# EasyEDA Pro project PCB_ESP32 Marauder 6.eprj

# Board PCB_ESP32 Marauder 6 PCB_2022-04-29
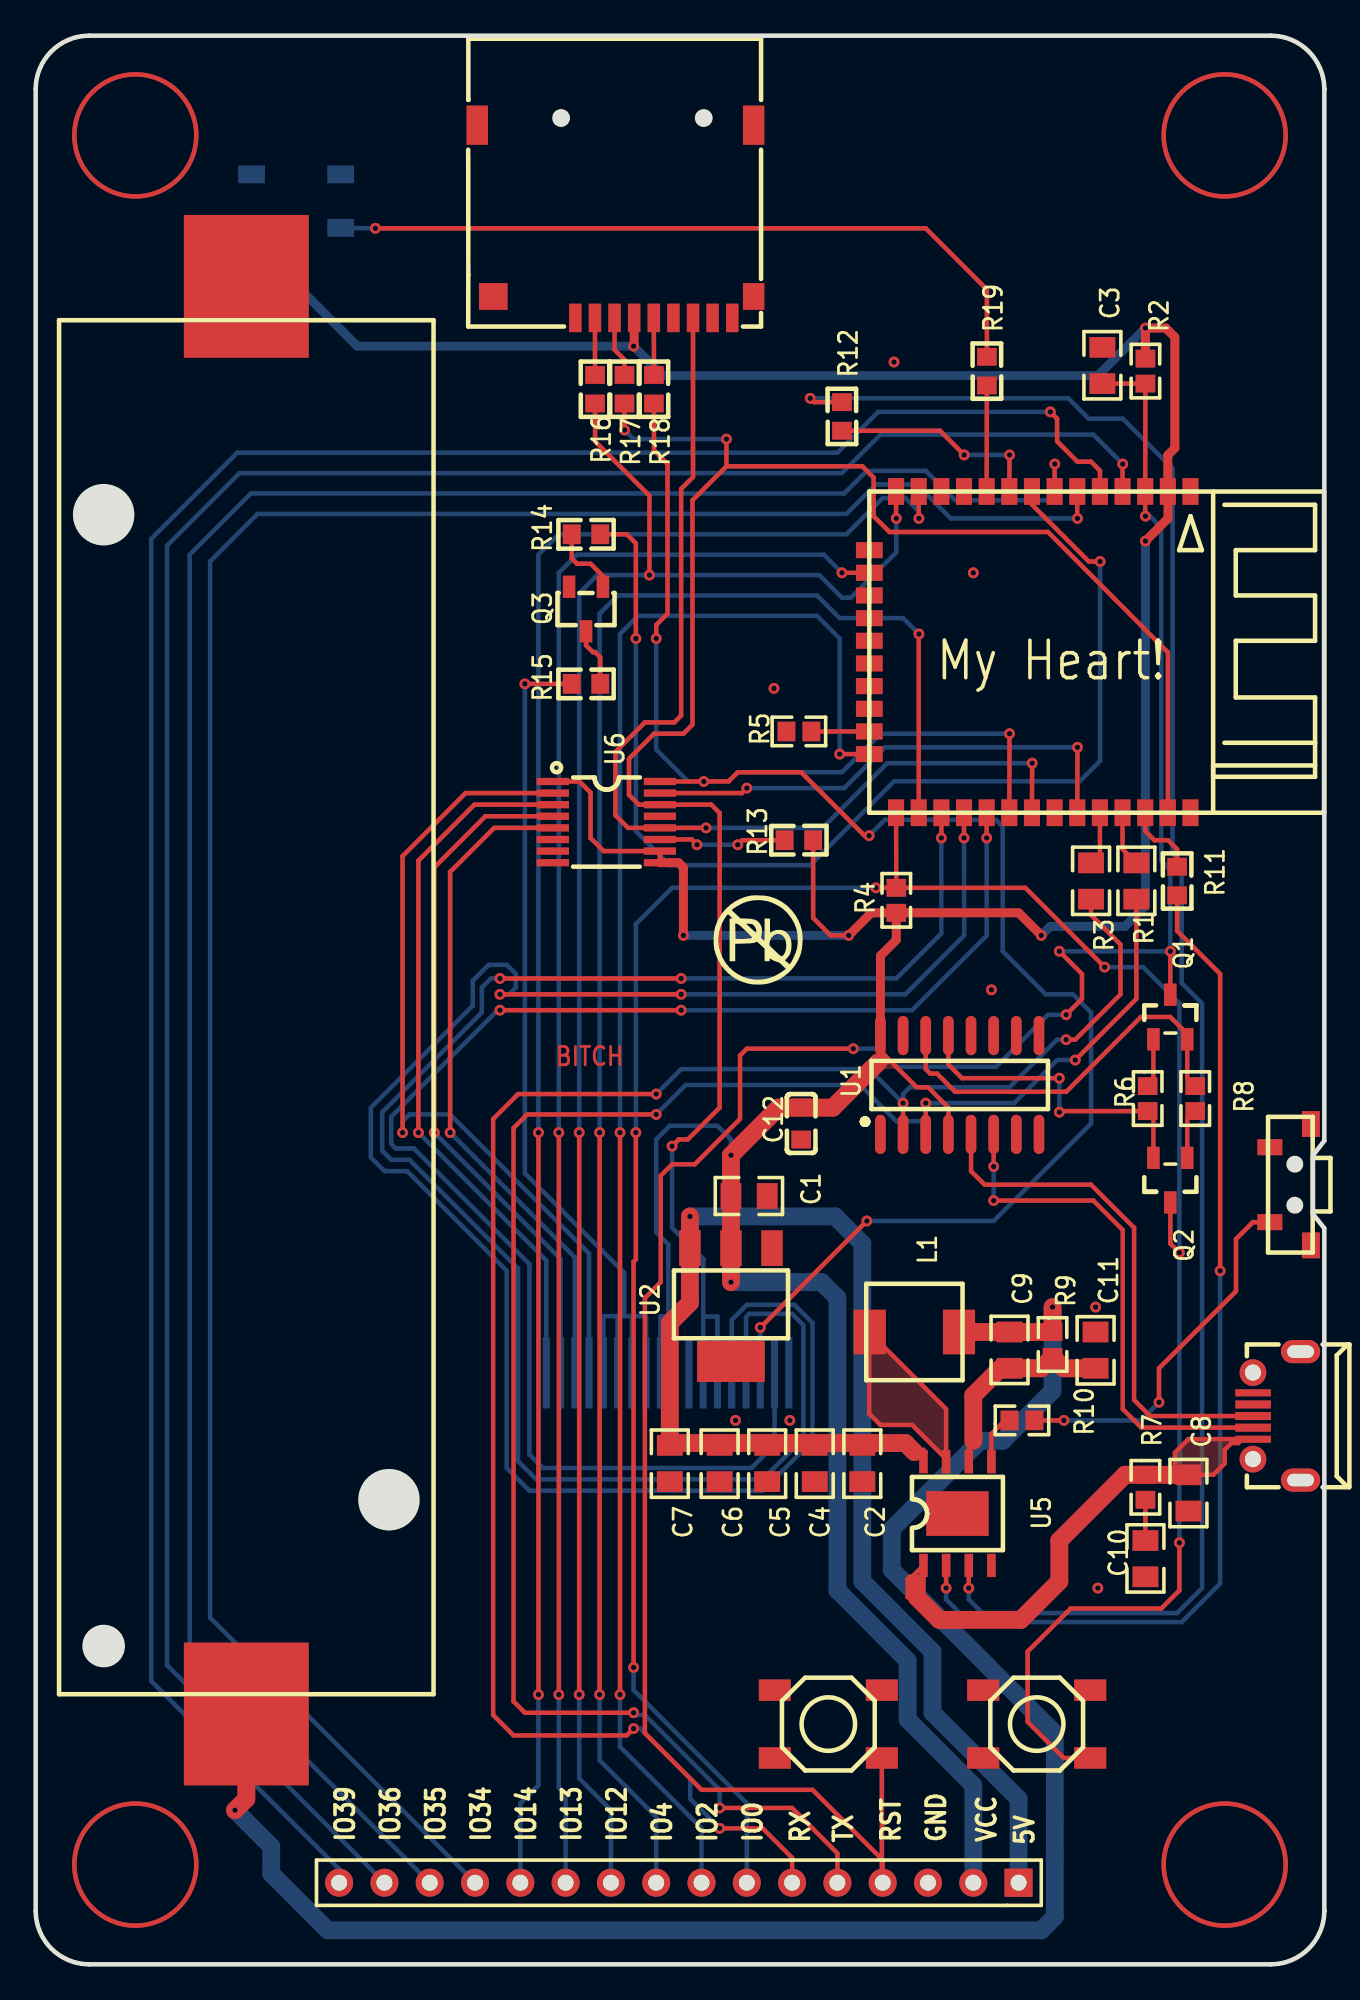
[diagram p0: board, top side]
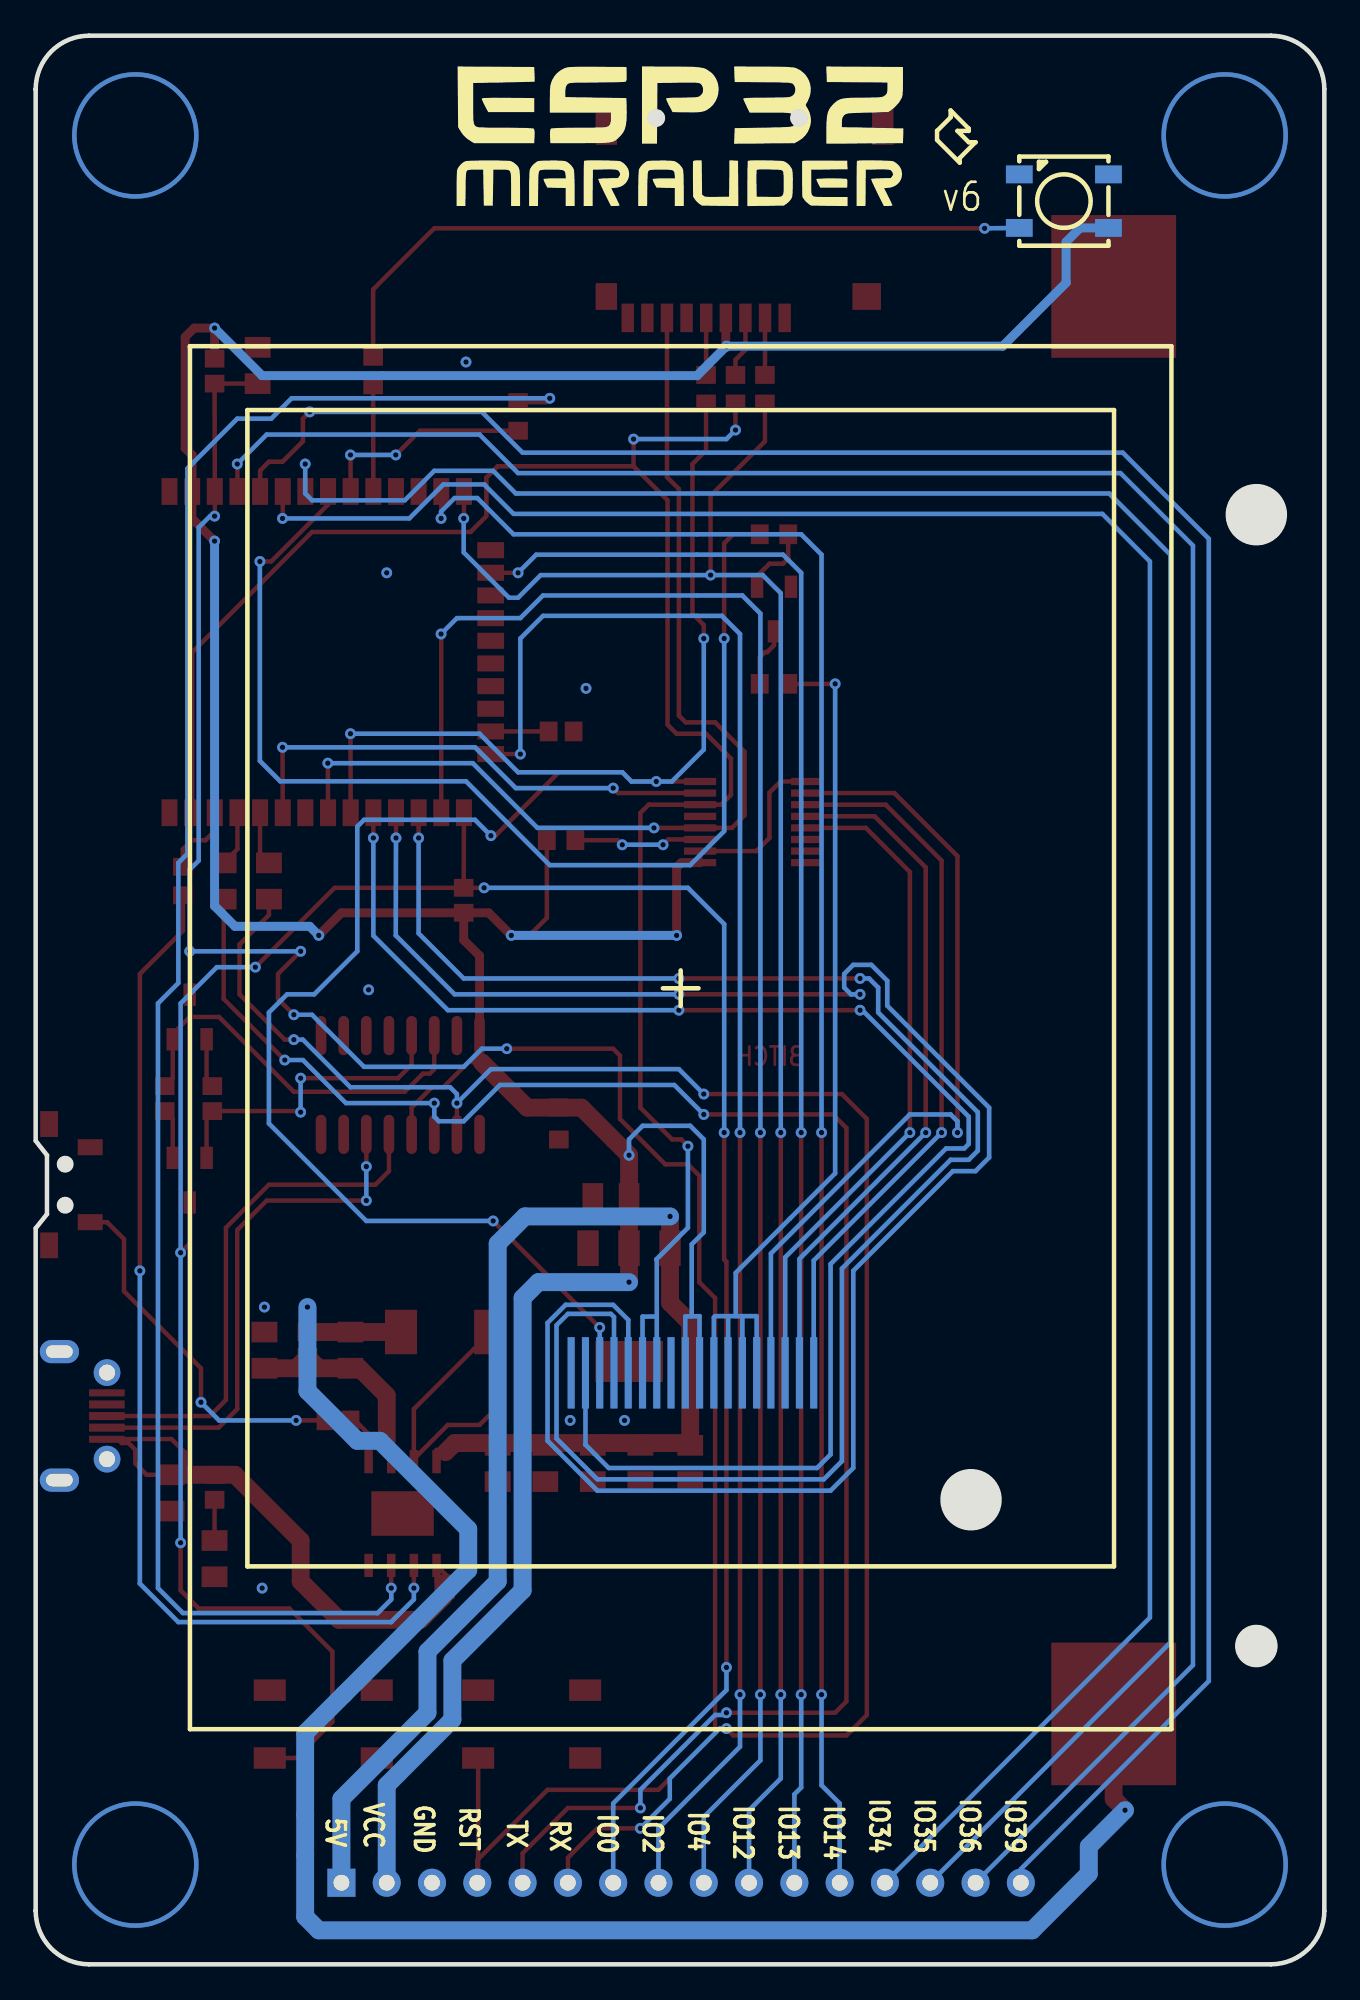
[diagram p1: board, bottom side, seen from below]

Outline 72.26 x 108.08 mm; copper layers: Top Layer, Bottom Layer. Coordinates in mm from the lower left corner of the outline.
Outline path: 0,105.08 arc(0.88,107.2) 3,108.08 69.26,108.08 arc(71.38,107.2) 72.26,105.08 72.26,46.15 71.63,45.34 71.63,42.04 72.26,41.25 72.26,3 arc(71.38,0.88) 69.26,0 3,0 arc(0.88,0.88) 0,3 0,105.08
Stack: Top Layer 0.035mm / Dielectric1 1.51mm FR4 er 4.5 / Bottom Layer 0.035mm

## Design rules (mm)
spacing Default (default): track to track 0.152, other pairs 0 to 0.152
track width Default (default): min 0.152, default 0.152, max 25.4
differential pair differentialPair (default): width min 0.127, default 0.254, max 2.54; gap min 0.152, default 0.152
via Default (default): diameter min 0.6, default 0.6, max 100.025; hole min 0.305, default 0.305, max 59.995
net GND uses (1)
pour e771 uses (1)

## Placement (name value [footprint] x y rotation side)
C1  10uF  [0805]  40.01 43.05 0 top
C2  100nF  [0805]  46.36 28.07 90 top
C3  100nF  [0805]  59.82 89.6 270 top
C4  22uF  [0805]  43.69 28.07 90 top
C5  22uF  [0805]  41.02 28.07 90 top
C6  22uF  [0805]  38.35 28.07 90 top
C7  22uF  [0805]  35.56 28.07 90 top
C8  10uF  [0805]  64.64 26.42 90 top
C9  22uF  [0805]  54.61 34.42 270 top
C10  10uF  [0805]  62.23 22.73 270 top
C11  22uF  [0805]  59.44 34.42 90 top
C12  100nF  [C0603]  42.93 47.12 90 top
CARD1  TF-115  [TF-SMD_TF-115]  32.51 97.66 180 top
FLASH1  FLASH  [KEY-5.2X5.2X1.5]  56.13 13.46 0 top
L1  1uH  [L-SMD-5.4X5.1]  49.28 35.43 0 top
LED1  WS2812B-B  [LED-SMD_4P-L5.0-W5.0-BL]  14.61 98.81 90 bottom
P1  Header-Female-2.54_1x16  [HDR-16X1/2.54]  36.07 4.57 270 top
Q1  S8050  [SOT-23(SOT-23-3)]  63.63 53.09 0 top
Q2  S8050  [SOT-23(SOT-23-3)]  63.63 43.94 180 top
Q3  S8050_C402279  [SOT-23-3_L3.0-W1.7-P0.95-LS2.9-BR]  30.86 75.95 90 top
R1  470Ω  [0805]  61.72 60.71 270 top
R2  10KΩ  [0603]  62.23 89.28 270 top
R3  470Ω  [0805]  59.18 60.71 270 top
R4  10KΩ  [0603]  48.26 59.62 90 top
R5  10KΩ  [0603]  42.8 69.09 0 top
R6  10KΩ  [0603]  62.36 48.51 270 top
R7  2  [0603]  62.23 26.73 270 top
R8  10KΩ  [0603]  65.02 48.51 90 top
R9  0.5  [0603]  57.02 34.73 270 top
R10  10KΩ  [0603]  55.31 30.48 0 top
R11  2.2K  [R0603]  64.01 60.71 270 top
R12  2.2K  [R0603]  45.21 86.74 90 top
R13  10K  [R0603]  42.8 62.99 0 top
R14  1K  [R0603]  30.86 80.14 180 top
R15  10  [R0603]  30.86 71.75 180 top
R16  1K  [R0603]  31.37 88.27 90 top
R17  1K  [R0603]  33.02 88.27 90 top
R18  1K  [R0603]  34.67 88.27 90 top
R19  330  [R0603]  53.34 89.28 270 top
RESET1  RESET  [KEY-5.2X5.2X1.5]  44.45 13.46 0 top
SW1  POWER  [KEY-TACT-SMD-7.6*3.5*3.5]  70.36 43.69 180 top
U1  CH340C  [SOP-16_150MIL]  51.82 49.28 90 top
U2  AMS1117-3.3  [SOT-223]  38.99 36.96 270 top
U3  -  [ESP-32S]  55.75 73.53 270 top
U5  IP5306  [ESOP-8-EP]  51.69 25.26 0 top
U6  XPT2046  [TSSOP-16_L5.0-W4.4-P0.65-LS6.4-BL]  32 64.01 270 top
U7  ILI9341_18_PIN  [ILI9341 18 PIN]  35.43 33.15 90 bottom
U8  1042P  [KEYSTONE 18650 BATTERY SLED]  19.81 26.03 270 top
USB1  MICROXNJ  [MICRO-USB-SMD_MICROXNJ]  69.6 30.73 0 top

## Footprints (pads in the part's own frame, mm; a bottom-side part is the same pattern mirrored in y, then rotated)
0603
  rect 1x1.1 smd: 1(-0.7,0) 2(0.7,0)
0805
  rect 1.16x1.45 smd: 1(-1.016,0) 2(1.016,0)
C0603
  rect 1x1.1 smd: 1(-0.9,0) 2(0.9,0)
ESOP-8-EP
  rect 0.48x1.3 smd: 1(-1.905,-2.909) 2(-0.635,-2.909) 3(0.635,-2.909) 4(1.905,-2.909) 5(1.905,2.909) 6(0.635,2.909) 7(-0.635,2.909) 8(-1.905,2.909)
  rect 3.5x2.5 smd: 9(0,0)
ESP-32S
  rect 1.5x0.9 smd: 1(-9,9.005) 2(-9,7.735) 3(-9,6.465) 4(-9,5.195) 5(-9,3.925) 6(-9,2.655) 7(-9,1.385) 8(-9,0.115) 9(-9,-1.155) 10(-9,-2.425) 11(-9,-3.695) 12(-9,-4.965) 13(-9,-6.235) 14(-9,-7.505) 25(9,-7.505) 26(9,-6.235) 27(9,-4.965) 28(9,-3.695) 29(9,-2.425) 30(9,-1.155) 31(9,0.115) 32(9,1.385) 33(9,2.655) 34(9,3.925) 35(9,5.195) 36(9,6.465) 37(9,7.735) 38(9,9.005)
  rect 0.9x1.5 smd: 15(-5.715,-9.005) 16(-4.445,-9.005) 17(-3.175,-9.005) 18(-1.905,-9.005) 19(-0.635,-9.005) 20(0.635,-9.005) 21(1.905,-9.005) 22(3.175,-9.005) 23(4.445,-9.005) 24(5.715,-9.005)
HDR-16X1/2.54
  rect 1.575x1.575 hole 0.889: 1(0,19.05)
  round 1.575 hole 0.889: 2(0,16.51) 3(0,13.97) 4(0,11.43) 5(0,8.89) 6(0,6.35) 7(0,3.81) 8(0,1.27) 9(0,-1.27) 10(0,-3.81) 11(0,-6.35) 12(0,-8.89) 13(0,-11.43) 14(0,-13.97) 15(0,-16.51) 16(0,-19.05)
ILI9341 18 PIN
  rect 4x0.4 smd: 1(0,6.8) 2(0,6) 3(0,5.2) 4(0,4.4) 5(0,3.6) 6(0,2.8) 7(0,2) 8(0,1.2) 9(0,0.4) 10(0,-0.4) 11(0,-1.2) 12(0,-2) 13(0,-2.8) 14(0,-3.6) 15(0,-4.4) 16(0,-5.2) 17(0,-6) 18(0,-6.8)
KEY-5.2X5.2X1.5
  rect 1.8x1.2 smd: 1(-3,1.9) 2(3,1.9) 3(-3,-1.9) 4(3,-1.9)
KEY-TACT-SMD-7.6*3.5*3.5
  rect 1.4x0.9 smd: 1(1.15,2.1) 2(1.15,-2.1)
  rect 1x1.45 smd: 3(-1.15,-3.4) 4(-1.15,3.4)
KEYSTONE 18650 BATTERY SLED
  rect 8x7 smd: 1(12.005,-8) 2(-67.993,-8)
L-SMD-5.4X5.1
  rect 1.8x2.5 smd: 1(-2.5,0) 2(2.5,0)
LED-SMD_4P-L5.0-W5.0-BL
  rect 1x1.5 smd: 1(-1.5,-2.5) 2(1.5,-2.5) 3(1.5,2.5) 4(-1.5,2.5)
MICRO-USB-SMD_MICROXNJ
  rect 2x0.4 smd: 1(-1.327,-1.31) 5(-1.327,1.29)
  rect 2x0.45 smd: 2(-1.327,-0.66) 3(-1.327,-0.011) 4(-1.327,0.639)
  round 1.5 hole 0.9: 6(-1.335,2.425) 9(-1.335,-2.425)
  oval 2.2x1.3 hole 1.5x0.7: 7(1.335,3.6) 8(1.335,-3.6)
R0603
  rect 1x1.1 smd: 1(-0.8,0) 2(0.8,0)
SOP-16_150MIL
  oval 2.2x0.6 smd: 1(-2.768,4.445) 2(-2.768,3.175) 3(-2.768,1.905) 4(-2.768,0.635) 5(-2.768,-0.635) 6(-2.768,-1.905) 7(-2.768,-3.175) 8(-2.768,-4.445) 9(2.768,-4.445) 10(2.768,-3.175) 11(2.768,-1.905) 12(2.768,-0.635) 13(2.768,0.635) 14(2.768,1.905) 15(2.768,3.175) 16(2.768,4.445)
SOT-23(SOT-23-3)
  rect 0.7x1.25 smd: 1(-0.95,-1.25) 2(0.95,-1.25) 3(0,1.25)
SOT-23-3_L3.0-W1.7-P0.95-LS2.9-BR
  rect 1.25x0.7 smd: 1(1.25,-0.95) 2(1.25,0.95) 3(-1.25,0)
SOT-223
  rect 2x1.2 smd: 1(-3.175,2.3) 2(-3.175,0) 3(-3.175,-2.3)
  rect 2.3x3.8 smd: 4(3.175,0)
TF-SMD_TF-115
  rect 0.7x1.6 smd: 1(2.25,5.4) 2(1.15,5.4) 3(0.05,5.4) 4(-1.05,5.4) 5(-2.15,5.4) 6(-3.25,5.4) 7(-4.35,5.4) 8(-5.45,5.4) 9(-6.55,5.4)
  rect 1.2x1.5 smd: 10(-7.75,4.2)
  rect 1.2x2.2 smd: 11(-7.75,-5.4) 12(7.75,-5.4)
  rect 1.6x1.5 smd: 13(6.85,4.2)
TSSOP-16_L5.0-W4.4-P0.65-LS6.4-BL
  rect 0.406x1.804 smd: 1(-2.275,-3) 2(-1.625,-3) 3(-0.975,-3) 4(-0.325,-3) 5(0.325,-3) 6(0.975,-3) 7(1.625,-3) 8(2.275,-3) 9(2.275,3) 10(1.625,3) 11(0.975,3) 12(0.325,3) 13(-0.325,3) 14(-0.975,3) 15(-1.625,3) 16(-2.275,3)

## Nets
GND: C1.2 C2.1 C3.1 C4.1 C5.1 C6.1 C7.1 C8.1 C10.2 C11.2 C12.1 CARD1.6 CARD1.10 CARD1.11 CARD1.12 CARD1.13 FLASH1.1 LED1.3 P1.3 Q3.2 R5.1 RESET1.1 SW1.2 SW1.3 SW1.4 U1.1 U2.1 U3.1 U3.15 U3.38 U5.9 U6.6 U6.7 U6.8 U7.1 U7.8 U8.2 USB1.5 USB1.6 USB1.7 USB1.8 USB1.9
VCC: C1.1 C12.2 CARD1.4 LED1.1 P1.2 R2.1 R4.1 R13.2 U1.4 U1.16 U2.2 U3.2 U6.1 U6.9 U6.10 U7.9 U7.10
VCC_IN: C8.2 R7.1 U5.1 USB1.1
VCC_OUT: C2.2 C4.2 C5.2 C6.2 C7.2 P1.1 U2.3 U5.8
CARD1_2: CARD1.2 R16.2
CARD1_3: CARD1.3 R17.2
CARD1_5: CARD1.5 R18.2
D+: U1.5 USB1.3
D-: U1.6 USB1.2
DTR: Q2.2 R6.2 U1.13
GPIO0: FLASH1.4 P1.7 Q2.3 R4.2 U3.25
GPIO2: P1.8 U3.24
GPIO4: P1.9 U3.26
GPIO5: U3.29 U7.2
GPIO12: P1.10 R16.1 U3.14
GPIO13: P1.11 U3.16
GPIO14: P1.12 U3.13
GPIO15: R5.2 U3.23
GPIO16: U3.27 U7.4
GPIO17: U3.28 U7.5
GPIO18: R18.1 U3.30 U6.16 U7.3
GPIO19: CARD1.7 U3.31 U6.12
GPIO21: U3.33 U6.15
GPIO23: R17.1 U3.37 U6.14 U7.6 U7.7
GPIO25: R19.2 U3.10
GPIO32: R14.1 U3.8
GPIO34: P1.13 U3.6
GPIO35: P1.14 U3.7
GPIO36: P1.15 U3.4
GPIO39: P1.16 U3.5
L1_2: C9.1 L1.2 R9.1 U8.1
LED1_4: LED1.4 R19.1
LEDK: R15.2 U7.11 U7.12 U7.13 U7.14
Q1_1: Q1.1 R6.1
Q2_1: Q2.1 R8.1
R1_1: R1.1 U3.35
R3_1: R3.1 U3.34
R7_2: C10.1 R7.2
R14_2: Q3.1 R14.2
R15_1: Q3.3 R15.1
RST: C3.2 P1.4 Q1.3 R2.2 RESET1.4 U3.3
RTS: Q1.2 R8.2 U1.14
RXD: P1.6 R3.2 U1.2
SCL: R11.1 U3.36
SDA: R12.1 U3.9
SW1_1: R10.2 SW1.1
T_IRQ: R13.1 U6.11
TXD: P1.5 R1.2 U1.3
U5_2: R11.2 U5.2
U5_3: R12.2 U5.3
U5_5: R10.1 U5.5
U5_6: C9.2 C11.1 R9.2 U5.6
U5_7: L1.1 U5.7
X+: U6.2 U7.15
X-: U6.4 U7.17
Y+: U6.3 U7.18
Y-: U6.5 U7.16

Pads without a net: CARD1 1 8 9; FLASH1 2 3; LED1 2; RESET1 2 3; U1 7 8 9 10 11 12 15; U2 4; U3 11 12 17 18 19 20 21 22 32; U5 4; U6 13; USB1 4

## Via types
v1: diameter 0.61, hole 0.305, Top Layer to Bottom Layer, 104 vias

## Routing (per net, layer and track width the routed paths; a pad name or vN(x,y) marks a point on that pad's centre or on a via; arc(x,y) is an arc through that point)
GND:
  vias: v1(39.24,30.48) v1(41.4,71.5) v1(42.29,30.48) v1(48.13,89.79) v1(52.58,77.98) v1(53.59,54.61) v1(59.44,36.83) v1(59.56,21.08)
VCC: length 241.7
  Top Layer w0.25: 47.63,50.93 47.24,50.55 ; 47.63,50.93 49.4,49.15 50.04,49.15 51.18,48.01 U1.4 ; 47.63,50.93 47.37,51.18 U1.16 ; 47.63,50.93 47.63,50.67 47.75,50.55
  Top Layer w0.254: R13.2 43.6,58.64 44.58,57.66 v1(45.59,57.66) ; U6.9 U6.10 31.85,62.38 31.11,63.12 31.11,65.66 30.49,66.28 U6.1
  Top Layer w0.5: v1(45.59,57.66) 46.86,58.92 R4.1 ; R4.1 48.26,57.4 47.37,56.52 U1.16 ; R4.1 55.12,58.92 v1(56.39,57.66) ; U3.2 63.49,84.57 63.88,84.96 63.88,91.19 63.37,91.69 v1(62.23,91.69) R2.1 ; v1(62.23,79.76) 63.5,81.03 63.5,82.55 ; U6.9 36.06,61.73 36.32,61.47 v1(36.32,57.66) ; CARD1.4 33.56,90.71 v1(33.53,90.68)
  Top Layer w1: 47.24,50.55 44.7,48.01 41.66,48.01 v1(38.99,45.34) C1.1 v1(38.99,38.23)
  Bottom Layer w0.254: 35.03,33.15 35.03,36.32 35.83,36.3 35.83,33.15 ; v1(38.99,45.34) 38.99,46.23 38.23,46.99 35.56,46.99 34.8,46.23 34.8,41.02 35.47,40.35 35.47,36.31
  Bottom Layer w0.5: v1(62.23,79.76) 62.23,59.31 61.09,58.17 56.9,58.17 v1(56.39,57.66) ; v1(62.23,91.69) 59.56,89.03 35.18,89.03 v1(33.53,90.68) 18.03,90.68 14.48,94.23 14.48,96.52 13.69,97.31 LED1.1 ; v1(45.59,57.66) v1(36.32,57.66)
  Bottom Layer w1: v1(38.99,38.23) 44.07,38.23 44.96,37.34 44.96,20.95 48.89,17.02 48.89,13.72 52.58,10.03 P1.2
VCC_IN: length 36.7
  Top Layer w0.25: 64.64,29.43 63.88,28.67 63.88,27.69 64.14,27.43 C8.2 66.04,27.43 66.67,28.07 66.67,28.83 67.06,29.21 67.44,29.21 67.66,29.43 68.13,29.43 64.64,29.43 ; 49.78,21.46 U5.1 49.15,21.72 49.02,21.72 48.89,21.59 48.89,20.57 49.78,21.46
  Top Layer w1: 64.51,27.43 61.09,27.43 57.4,23.75 57.4,21.46 55.24,19.3 50.67,19.3 49.4,20.57 49.4,21.34
VCC_OUT: length 78.2
  Top Layer w0.25: 49.28,28.7 49.66,28.7 49.78,28.83 U5.8
  Top Layer w1: 35.56,29.21 48.77,29.21 49.28,28.7 ; v1(36.69,41.91) 36.69,37.07 35.56,35.94 C7.2
  Bottom Layer w1: P1.1 55.12,9.27 50.29,14.1 50.29,17.53 46.36,21.46 46.36,40.39 44.83,41.91 v1(36.69,41.91)
CARD1_2: length 3.2
  Top Layer w0.254: R16.2 CARD1.2
CARD1_3: length 3.4
  Top Layer w0.254: 32.46,92.26 32.46,90.47 33.02,89.92 R17.2
CARD1_5: length 3.2
  Top Layer w0.254: R18.2 CARD1.5
D+: length 29.2
  Top Layer w0.25: U1.5 52.45,44.45 53.21,43.69 59.18,43.69 61.6,41.27 61.6,31.62 62.49,30.72 USB1.3
D-: length 29.4
  Top Layer w0.25: USB1.2 62,30.07 60.96,31.11 60.96,41.15 59.31,42.8 v1(53.72,42.8) ; v1(53.72,44.7) U1.6
  Bottom Layer w0.25: v1(53.72,42.8) v1(53.72,44.7)
DTR: length 17.8
  Top Layer w0.25: v1(57.4,49.66) 51.94,49.66 51.18,50.42 U1.13 ; v1(57.4,47.75) 57.47,47.81 R6.2 62.68,47.49 Q2.2
  Bottom Layer w0.25: v1(57.4,49.66) v1(57.4,47.75)
GPIO0: length 148.9
  Top Layer w0.25: v1(59.94,55.88) 55.5,60.33 R4.2 U3.25 ; v1(64.14,39.88) 63.63,40.39 Q2.3 ; 48.39,60.33 v1(47.12,60.33)
  Top Layer w0.254: FLASH1.4 57.65,11.56 55.63,13.59 55.63,17.53 58.04,19.94 63.12,19.94 64.14,20.95 v1(64.14,23.62) ; v1(33.53,16.64) 33.53,39.37 33.65,39.5 v1(33.65,46.61)
  Bottom Layer w0.25: v1(64.14,23.62) v1(64.14,39.88) 64.14,53.85 62.1,55.88 v1(59.94,55.88)
  Bottom Layer w0.254: v1(33.53,16.64) 33.53,15.37 39.88,9.02 P1.7 ; v1(33.65,46.61) 33.65,58.29 35.69,60.33 v1(47.12,60.33)
GPIO2: length 93.3
  Top Layer w0.25: U3.24 v1(45.08,67.82)
  Top Layer w0.254: v1(32.77,46.61) v1(32.77,15.11)
  Bottom Layer w0.25: v1(45.08,67.82) 45.08,74.3 43.82,75.56 35.18,75.56
  Bottom Layer w0.254: v1(32.77,15.11) 32.77,12.19 37.34,7.62 P1.8 ; v1(32.77,46.61) 32.77,74.55 33.78,75.56 35.18,75.56
GPIO4: length 101.7
  Top Layer w0.25: U3.26 49.52,74.54 v1(49.53,74.55)
  Top Layer w0.254: v1(31.62,46.61) v1(31.62,15.11)
  Bottom Layer w0.25: 35.18,76.71 43.82,76.71 45.08,75.44 48.64,75.44 v1(49.53,74.55)
  Bottom Layer w0.254: v1(31.62,15.11) 31.62,11.43 34.8,8.25 P1.9 ; 35.18,76.71 32.64,76.71 31.62,75.69 v1(31.62,46.61)
GPIO5: length 85.8
  Top Layer w0.254: v1(36.2,53.47) v1(26.04,53.47) ; U3.29 v1(53.33,63.12)
  Bottom Layer w0.254: v1(26.04,53.47) 25.91,53.47 19.94,47.5 19.94,45.97 20.19,45.72 21.21,45.72 27.69,39.24 27.69,28.57 28.45,27.81 40.13,27.81 41.43,29.11 U7.2 ; v1(36.2,53.47) 49.15,53.47 53.33,57.65 v1(53.33,63.12)
GPIO12: length 107.1
  Top Layer w0.25: v1(48.26,81.03) 48.25,81.04 U3.14
  Top Layer w0.254: v1(34.42,77.85) 34.42,82.3 31.37,85.34 R16.1 ; v1(30.48,46.61) v1(30.48,15.11)
  Bottom Layer w0.25: v1(48.26,81.03) 48.26,79.12 45.72,76.58 45.21,76.58 43.94,77.85 v1(34.42,77.85)
  Bottom Layer w0.254: P1.10 32.26,8.64 30.48,10.41 v1(30.48,15.11) ; v1(34.42,77.85) 31.5,77.85 30.48,76.83 v1(30.48,46.61)
GPIO13: length 91.8
  Top Layer w0.25: v1(45.21,77.98) 46.75,77.98
  Top Layer w0.254: v1(29.34,46.61) v1(29.34,15.11)
  Bottom Layer w0.25: v1(45.21,77.98) 44.2,78.99 35.18,78.99
  Bottom Layer w0.254: v1(29.34,46.61) 29.34,77.98 30.35,78.99 35.18,78.99 ; v1(29.34,15.11) 29.34,9.91 29.72,9.53 P1.11
GPIO14: length 99.7
  Top Layer w0.25: v1(49.53,81.03) 49.52,81.04 U3.13
  Top Layer w0.254: v1(28.19,46.61) v1(28.19,15.11)
  Bottom Layer w0.25: 35.18,80.14 45.47,80.14 47.5,82.17 48.77,82.17 49.53,81.41 v1(49.53,81.03)
  Bottom Layer w0.254: v1(28.19,15.11) 28.19,10.03 27.18,9.02 P1.12 ; v1(28.19,46.61) 28.19,78.99 29.34,80.14 35.18,80.14
GPIO15: length 3.2
  Top Layer w0.25: R5.2 U3.23
GPIO16: length 96.8
  Top Layer w0.254: v1(36.2,55.25) v1(26.04,55.25) ; U3.27 v1(50.79,63.12)
  Bottom Layer w0.254: v1(26.04,55.25) 25.53,55.25 25.02,54.74 25.02,53.34 19.43,47.75 19.43,45.59 19.94,45.08 20.95,45.08 27.05,38.99 27.05,28.19 28.07,27.18 40.77,27.18 43.05,29.46 43.05,35.81 42.42,36.45 40.01,36.45 39.83,36.28 U7.4 ; v1(50.79,63.12) 50.79,57.77 48.26,55.25 v1(36.2,55.25)
GPIO17: length 106.3
  Top Layer w0.254: U3.28 v1(52.06,63.12) ; v1(26.04,54.36) v1(36.2,54.36)
  Bottom Layer w0.254: U7.5 39.03,36.11 39.88,36.96 42.55,36.96 43.56,35.94 43.56,29.34 40.77,26.54 27.69,26.54 26.42,27.81 26.42,38.86 20.83,44.45 19.56,44.45 18.8,45.21 18.8,48.01 24.51,53.72 24.51,55.12 25.4,56.01 26.42,56.01 26.92,55.5 26.92,54.74 26.54,54.36 v1(26.04,54.36) ; 52.06,63.12 52.07,57.66 48.77,54.36 v1(36.2,54.36)
GPIO18: length 112.9
  Top Layer w0.254: 37.46,66.28 38.86,66.29 39.37,66.8 42.93,66.8 46.48,63.25 v1(46.74,63.25) ; v1(54.61,68.96) 54.6,64.53 ; v1(40.63,35.69) 40.64,35.69 v1(46.61,41.66) ; R18.1 34.67,84.84 35.43,84.07 35.43,75.69 34.8,75.06 v1(34.8,74.3) ; U6.16 v1(37.46,66.28)
  Bottom Layer w0.254: v1(46.74,63.25) 47.63,64.14 53.85,64.14 54.23,63.75 54.23,56.77 56.64,54.36 58.17,54.36 59.18,53.34 59.18,47.12 53.72,41.66 v1(46.61,41.66) ; U7.3 v1(40.63,35.69) ; v1(54.61,68.96) 47.37,68.96 45.21,66.8 39.37,66.8 38.85,66.28 v1(37.46,66.28) 36.59,66.28 34.8,68.07 v1(34.8,74.3)
GPIO19: length 58.6
  Top Layer w0.254: v1(55.88,67.31) U3.31 ; 36.86,92.26 36.86,83.34 36.2,82.68 36.2,69.98 35.81,69.6 34.16,69.6 32.51,67.94 32.51,64.39 33.22,63.68 U6.12 v1(37.59,63.68)
  Bottom Layer w0.254: v1(55.88,67.31) 47.75,67.31 44.13,63.68 v1(37.59,63.68)
GPIO21: length 28.1
  Top Layer w0.254: v1(58.42,68.2) U3.33 ; U6.15 39.6,65.63 v1(39.88,65.91)
  Bottom Layer w0.254: v1(58.42,68.2) 47.63,68.2 45.34,65.91 v1(39.88,65.91)
GPIO23: length 112.9
  Top Layer w0.254: v1(33.02,85.98) R17.1 ; U3.37 63.49,73.52 56.77,80.26 47.88,80.26 46.99,81.15 46.99,83.31 46.36,83.95 38.73,83.95 ; 38.73,83.95 36.83,82.04 36.83,69.47 36.32,68.96 34.67,68.96 33.27,67.56 33.27,65.53 33.82,64.98 U6.14 37.85,64.98 37.89,64.98 38.35,64.52 38.35,48.01 36.58,46.23 36.07,46.23 v1(35.69,45.85) ; 38.73,83.95 v1(38.73,85.47)
  Bottom Layer w0.254: U7.7 37.43,39.47 37.46,39.5 35.69,41.27 v1(35.69,45.85) ; 37.43,36.3 38.23,36.3 38.23,33.15 ; v1(33.02,85.98) 33.53,85.47 v1(38.73,85.47)
GPIO25: length 5.9
  Top Layer w0.254: R19.2 U3.10
GPIO32: length 64.6
  Top Layer w0.254: R14.1 33.15,80.14 33.65,79.63 v1(33.65,74.3) ; U3.8 55.87,81.8 59.05,78.61 v1(59.69,78.61)
  Bottom Layer w0.254: v1(33.65,74.3) 33.65,63.5 35.56,61.59 43.43,61.59 48.13,66.29 58.55,66.29 59.69,67.44 v1(59.69,78.61)
GPIO34: length 132.9
  Top Layer w0.25: U3.6 58.41,81.04 v1(58.42,81.03)
  Bottom Layer w0.25: P1.13 9.78,19.43 9.78,78.61 12.45,81.28 45.47,81.28 47.12,82.93 49.4,82.93 51.31,81.03 v1(58.42,81.03)
GPIO35: length 134.5
  Top Layer w0.25: v1(57.15,84.07) 57.14,84.06 U3.7
  Bottom Layer w0.25: v1(57.15,84.07) 57.15,82.42 56.77,82.04 51.56,82.04 49.91,83.69 46.61,83.69 45.34,82.42 35.18,82.42
  Bottom Layer w0.254: P1.14 8.64,18.03 8.64,78.99 12.07,82.42 35.18,82.42
GPIO36: length 138.4
  Top Layer w0.25: U3.4 60.95,84.06 v1(60.96,84.07)
  Bottom Layer w0.25: v1(60.96,84.07) 59.31,85.72 47.37,85.72 45.21,83.57 11.43,83.57 7.37,79.5 7.37,16.76 P1.15
GPIO39: length 139.1
  Top Layer w0.254: v1(56.9,87) 57.28,86.61 57.28,85.34 58.42,84.2 59.18,84.2 59.68,83.7 U3.5
  Bottom Layer w0.25: 35.18,84.71 44.96,84.71 47.24,87 v1(56.9,87)
  Bottom Layer w0.254: P1.16 17.02,5.33 6.48,15.88 6.48,79.88 11.3,84.71 35.18,84.71
L1_2: length 104.7
  Top Layer w1: U8.1 11.81,9.27 v1(11.18,8.64) ; L1.2 C9.1 R9.1 v1(57.02,36.83)
  Bottom Layer w1: v1(57.02,36.83) 57.02,32.13 54.23,29.34 52.96,29.34 48.01,24.38 48.01,22.1 57.15,12.95 57.15,2.67 56.39,1.91 16.38,1.91 13.21,5.08 13.21,6.6 v1(11.18,8.64)
LED1_4: length 41.4
  Top Layer w0.254: R19.1 53.34,93.85 49.91,97.28 v1(19.05,97.28)
  Bottom Layer w0.254: v1(19.05,97.28) LED1.4
LEDK: length 55.4
  Top Layer w0.254: v1(27.43,71.75) R15.2
  Bottom Layer w0.254: U7.12 33.43,36.32 ; v1(27.43,71.75) 27.43,44.32 33.01,38.75 33.01,36.32 ; U7.14 31.83,36.32 34.16,36.32 34.23,36.25 U7.11 ; U7.13 32.63,36.32
Q1_1: length 2.8
  Top Layer w0.25: Q1.1 62.68,49.53 R6.1
Q2_1: length 2.8
  Top Layer w0.25: R8.1 64.58,47.37 Q2.1
R1_1: length 3.1
  Top Layer w0.25: U3.35 60.95,62.5 61.72,61.72
R3_1: length 3
  Top Layer w0.25: U3.34 59.68,62.22 59.18,61.72
R7_2: length 2.3
  Top Layer w0.25: R7.2 C10.1
R14_2: length 4.1
  Top Layer w0.254: R14.2 30.06,78.78 30.35,78.49 31.11,78.49 31.81,77.79 Q3.1
R15_1: length 3.3
  Top Layer w0.254: R15.1 31.66,73.24 31.37,73.53 31.24,73.53 30.86,73.91 Q3.3
RST: length 133.6
  Top Layer w0.25: v1(63.63,56.77) Q1.3 ; v1(45.85,51.31) 39.88,51.31 39.5,50.93 39.5,47.37 36.96,44.83 35.69,44.83 35.05,44.2 35.05,38.23 34.16,37.34 34.16,12.95 37.34,9.78 43.56,9.78 47.5,5.84 P1.4 ; v1(57.4,56.77) 58.67,55.5 58.67,54.1 v1(57.79,53.21) ; U3.3 62.22,81.16 v1(62.23,81.15) ; C3.2 R2.2
  Top Layer w0.254: P1.4 47.45,4.62 RESET1.4 ; R2.2 62.22,82.53
  Bottom Layer w0.25: v1(57.79,53.21) 56.77,53.21 53.85,50.29 48.26,50.29 47.24,51.31 v1(45.85,51.31) ; v1(62.23,81.15) 62.48,81.15 63.12,80.52 63.12,61.85 63.63,61.34 v1(63.63,56.77) v1(57.4,56.77)
RTS: length 22.3
  Top Layer w0.25: U1.14 49.91,50.16 50.17,49.91 50.55,49.91 51.56,48.89 57.79,48.89 61.98,53.09 63.63,53.09 64.58,52.14 Q1.2 64.58,49.66 R8.2
RXD: length 103.6
  Top Layer w0.25: U1.2 v1(48.64,48.26) ; v1(57.79,51.82) 58.29,51.82 60.83,54.36 60.83,57.15 59.18,58.8 R3.2 ; P1.6 42.42,5.97 40.77,7.62 v1(38.35,7.62) ; v1(33.53,13.21) 33.15,12.83 26.8,12.83 25.65,13.97 25.65,47.37 27.05,48.77 v1(34.8,48.77)
  Bottom Layer w0.25: v1(38.35,7.62) 36.7,9.27 36.7,10.41 33.91,13.21 v1(33.53,13.21) ; v1(57.79,51.82) 57.28,51.82 54.61,49.15 49.02,49.15 48.64,48.77 v1(48.64,48.26) 46.74,50.16 36.2,50.16 v1(34.8,48.77)
SCL: length 4.2
  Top Layer w0.254: 64.01,61.51 64.01,62.48 63.5,62.99 62.74,62.99 62.22,63.51 U3.36
SDA: length 12
  Top Layer w0.254: R12.1 50.71,85.94 v1(52.07,84.58) ; v1(54.61,84.58) 54.6,82.53
  Bottom Layer w0.254: v1(52.07,84.58) v1(54.61,84.58)
SW1_1: length 20.6
  Top Layer w0.254: R10.2 v1(57.66,30.48) ; SW1.1 68.26,41.59 67.31,40.64 67.31,37.72 62.99,33.4 v1(62.99,31.5)
  Bottom Layer w0.254: v1(62.99,31.5) 61.98,30.48 v1(57.66,30.48)
T_IRQ: length 7.2
  Top Layer w0.254: v1(37.08,62.74) 36.79,63.03 U6.11 ; R13.1 39.62,62.99 v1(39.37,62.74)
  Bottom Layer w0.254: v1(37.08,62.74) v1(39.37,62.74)
TXD: length 103.5
  Top Layer w0.25: U1.3 v1(49.91,48.26) ; v1(33.53,14.1) 27.43,14.1 26.8,14.73 26.8,46.86 27.56,47.62 v1(34.8,47.62) ; 44.96,4.57 44.96,6.22 42.42,8.76 v1(38.35,8.76) ; v1(58.29,50.67) 61.72,54.1 R1.2
  Bottom Layer w0.25: v1(34.8,47.62) 36.45,49.28 46.23,49.28 48.26,47.24 49.66,47.24 49.91,47.5 v1(49.91,48.26) 54.86,48.26 57.28,50.67 v1(58.29,50.67)
  Bottom Layer w0.254: v1(38.35,8.76) 38.35,9.78 34.16,13.97 33.65,13.97 v1(33.53,14.1)
U5_2: length 58.3
  Top Layer w0.25: U5.2 v1(51.05,21.08)
  Top Layer w0.254: v1(66.42,38.86) 66.42,55.5 64.01,57.91 64.01,59.91
  Bottom Layer w0.254: v1(51.05,21.08) 51.05,20.45 52.32,19.18 64.26,19.18 66.42,21.34 v1(66.42,38.86)
U5_3: length 103.1
  Top Layer w0.25: U5.3 v1(52.32,21.08)
  Top Layer w0.254: R12.2 43.65,87.54 v1(43.43,87.76)
  Bottom Layer w0.254: v1(43.43,87.76) 57.91,87.76 59.05,86.61 60.96,86.61 63.75,83.82 63.75,62.23 64.26,61.72 64.26,54.99 65.4,53.85 65.4,21.08 64.01,19.69 53.09,19.69 52.32,20.45 v1(52.32,21.08)
U5_5: length 2.9
  Top Layer w0.25: R10.1 54.36,30.48 53.59,29.72 U5.5
U5_6: length 12
  Top Layer w0.25: 52.58,29.34 52.32,29.34 U5.6
  Top Layer w1: C11.1 57.65,33.4 R9.2 56.39,33.4 C9.2 54.1,33.4 52.58,31.88 52.58,29.34
U5_7: length 19.1
  Top Layer w0.25: 46.74,35.39 46.74,30.86 47.37,30.23 49.15,30.23 51.05,28.32 U5.7 51.05,31.11 46.78,35.39 L1.1 46.74,35.39
X+: length 46.6
  Top Layer w0.254: v1(20.57,46.61) 20.57,62.1 24.1,65.63 U6.2
  Bottom Layer w0.254: U7.15 31.03,39.83 23.24,47.62 20.95,47.62 20.57,47.24 v1(20.57,46.61)
X-: length 39.1
  Top Layer w0.254: U6.4 25.22,64.33 22.35,61.47 v1(22.35,46.61)
  Bottom Layer w0.254: U7.17 29.43,39.53 v1(22.35,46.61)
Y+: length 40.5
  Top Layer w0.254: U6.3 24.6,64.98 21.46,61.85 v1(21.46,46.61)
  Bottom Layer w0.254: v1(21.46,46.61) 28.63,39.44 U7.18
Y-: length 37.7
  Top Layer w0.254: v1(23.24,46.61) 23.24,61.21 25.71,63.68 U6.5
  Bottom Layer w0.254: U7.16 30.23,39.62 v1(23.24,46.61)

## Copper pours and planes (outline as drawn; the poured copper is in the pictures)
GND on Top Layer: -3.94,-5.59 -3.17,111.89 21.59,112.52 73.79,112.39 73.79,90.42 65.91,83.31 65.91,62.99 73.66,55.63 73.79,-3.43 68.33,-5.08
GND on Bottom Layer: -2.92,-3.43 -1.02,109.85 74.55,113.03 73.79,90.68 65.91,83.44 65.91,63.25 73.79,55.75 73.53,-4.83
VCC_IN on Top Layer: 63.88,29.46 67.44,29.46 67.44,27.43 63.88,27.43
U5_7 on Top Layer: 46.74,34.92 51.05,34.92 51.05,28.57 46.74,28.57

Small or netless copper shapes (teardrops, artwork), in the pictures only: 2 on Top Layer

## Text on the board
Bottom Silkscreen Layer: IO39 | IO36 | IO35 | IO34 | IO14 | IO13 | IO12 | IO4 | IO2 | IO0 | RX | TX | RST | GND | 5V | VCC | v6
Document Layer: I2C Charging
Top Layer: BITCH
Top Silkscreen Layer: IO39 | IO36 | IO35 | IO34 | IO14 | IO13 | IO12 | IO4 | IO2 | IO0 | RX | TX | RST | GND | 5V | VCC | My Heart!
